# Altium schematic sheet CONN.SchDoc: CONN
size A4; DocumentNumber: 14; Revision: 1.9; SheetNumber: 14; SheetTotal: 18
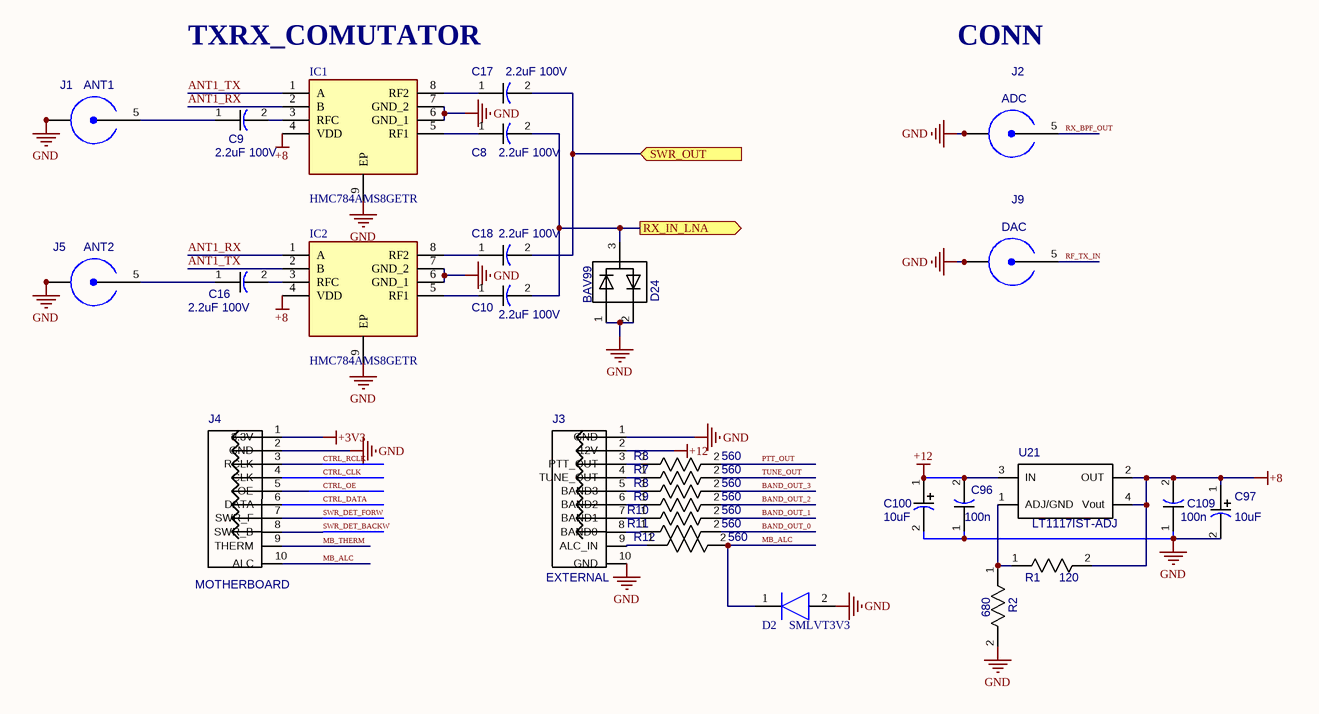
[diagram p0: CONN.SchDoc]

## Parts
C8  value 2.2uF 100V  [CAP_1206]  (hidden comment: CAP_1206)
C9  value 2.2uF 100V  [CAP_1206]  (hidden comment: CAP_1206)
C10  value 2.2uF 100V  [CAP_1206]  (hidden comment: CAP_1206)
C16  value 2.2uF 100V  [CAP_1206]  (hidden comment: CAP_1206)
C17  value 2.2uF 100V  [CAP_1206]  (hidden comment: CAP_1206)
C18  value 2.2uF 100V  [CAP_1206]  (hidden comment: CAP_1206)
C96  100n  [CAP_0805]
C97  10uF  [CAPAE_5.3x5.3h6.1]
C100  10uF  [CAPAE_5.3x5.3h6.1]
C109  100n  [CAP_0805]
D2  SMLVT3V3  [SMBJ36CATR]
D24  BAV99  [SOT23]
IC1  HMC784AMS8GETR  [SOP65P488X110-9N]
IC2  HMC784AMS8GETR  [SOP65P488X110-9N]
J1  ANT1  [31-5431]
J2  ADC  [31-5431]
J3  EXTERNAL  [90131-0126]
J4  MOTHERBOARD  [90131-0126]
J5  ANT2  [31-5431]
J9  DAC  [31-5431]
R1  value 120  [RES_0805]  (hidden comment: RES_0805)
R2  value 680  [RES_0805]  (hidden comment: RES_0805)
R3  value 560  [RES_0805]  (hidden comment: RES_0805)
R7  value 560  [RES_0805]  (hidden comment: RES_0805)
R8  value 560  [RES_0805]  (hidden comment: RES_0805)
R9  value 560  [RES_0805]  (hidden comment: RES_0805)
R10  value 560  [RES_0805]  (hidden comment: RES_0805)
R11  value 560  [RES_0805]  (hidden comment: RES_0805)
R12  value 560  [RES_0805]  (hidden comment: RES_0805)
U21  LT1117IST-ADJ  [LT1117IST-ADJ]

## Ports
RX_IN_LNA (out), SWR_OUT (in)

## Nets
+3V3: J4.1(3.3V)
+8: C97.1(PLUS) C109.2 IC1.4(VDD) IC2.4(VDD) R1.2 U21.2(OUT) U21.4(Vout)
+12: C96.2 C100.1(PLUS) J3.2(12V) U21.3(IN)
GND: C96.1 C97.2(MINUS) C100.2(MINUS) C109.1 D2.2(A) D24.1(A(D1)) D24.2(C(D2)) IC1.6(GND_1) IC1.7(GND_2) IC1.9(EP) IC2.6(GND_1) IC2.7(GND_2) IC2.9(EP) J1.1(GND) J1.2(GND) J1.3(GND) J1.4(GND) J2.1(GND) J2.2(GND) J2.3(GND) J2.4(GND) J3.1(GND) J3.10(GND) J4.2(GND) J5.1(GND) J5.2(GND) J5.3(GND) J5.4(GND) J9.1(GND) J9.2(GND) J9.3(GND) J9.4(GND) R2.2
ANT1_RX: IC1.2(B) IC2.1(A)
ANT1_TX: IC1.1(A) IC2.2(B)
BAND_OUT_0: R11.2
BAND_OUT_1: R10.2
BAND_OUT_2: R9.2
BAND_OUT_3: R8.2
CTRL_CLK: J4.4(CLK)
CTRL_DATA: J4.6(DATA)
CTRL_OE: J4.5(OE)
CTRL_RCLK: J4.3(RCLK)
MB_ALC: D2.1(K) J4.10(ALC) R12.2
MB_THERM: J4.9(THERM)
PTT_OUT: R3.2
RF_TX_IN: J9.5(CON)
RX_BPF_OUT: J2.5(CON)
RX_IN_LNA: C8.2 C10.2 D24.3(C(D1),A(D2)) ; port RX_IN_LNA
SWR_DET_BACKW: J4.8(SWR_B)
SWR_DET_FORW: J4.7(SWR_F)
SWR_OUT: C17.2 C18.2 ; port SWR_OUT
TUNE_OUT: R7.2
NetC8_1: C8.1 IC1.5(RF1)
NetC9_1: C9.1 J1.5(CON)
NetC9_2: C9.2 IC1.3(RFC)
NetC10_1: C10.1 IC2.5(RF1)
NetC16_1: C16.1 J5.5(CON)
NetC16_2: C16.2 IC2.3(RFC)
NetC17_1: C17.1 IC1.8(RF2)
NetC18_1: C18.1 IC2.8(RF2)
NetJ3_3: J3.3(PTT_OUT) R3.1
NetJ3_4: J3.4(TUNE_OUT) R7.1
NetJ3_5: J3.5(BAND3) R8.1
NetJ3_6: J3.6(BAND2) R9.1
NetJ3_7: J3.7(BAND1) R10.1
NetJ3_8: J3.8(BAND0) R11.1
NetJ3_9: J3.9(ALC_IN) R12.1
NetR1_1: R1.1 R2.1 U21.1(ADJ/GND)

## Notes on the sheet
- (near IC1) TXRX_COMUTATOR
- CONN
- Title
- Size:
- Date:
- A4
- Number:
- Time:
- Revision:
- Sheet
- of
- File:

## Library data of the parts
C96 C109 = CAP_0805: Value: 100n
C97 C100 = EEEFC_sizeB
  C100: Value: 10uF
D2 = SMLVT3V3: Diode; Manufacturer_Name: STMicroelectronics; Allied_Number: 70013736; Datasheet Link: http://www.st.com/web/en/resource/technical/document/datasheet/CD00000923.pdf; Height: 2.65mm; Manufacturer_Part_Number: SMLVT3V3; Mouser Part Number: 511-SMLVT3V3; Mouser Price/Stock: https://www.mouser.com/Search/Refine.aspx?Keyword=511-SMLVT3V3; RS Part Number: 5444821P; RS Price/Stock: http://uk.rs-online.com/web/p/products/5444821P; Allied Price/Stock: http://www.alliedelec.com/stmicroelectronics-smlvt3v3/70013736/
IC1 IC2 = HMC784AMS8GETR: Integrated Circuit; Manufacturer_Name: Analog Devices; Datasheet Link: https://componentsearchengine.com/Datasheets/1/HMC784AMS8GETR.pdf; Height: 1.1mm; Manufacturer_Part_Number: HMC784AMS8GETR; Mouser Part Number: 584-HMC784AMS8GETR; Mouser Price/Stock: https://www.mouser.co.uk/ProductDetail/Analog-Devices/HMC784AMS8GETR?qs=cslStgdnz9MA9T236Uh9mQ%3D%3D
J1 J2 J5 J9 = 31-5431
  J1: Value: ANT1
  J2: Value: ADC
  J5: Value: ANT2
  J9: Value: DAC
J3 J4 = 90131-0126: Value: *
U21 = LT1117CST-3.3
D24 = BAV99: Value: BAV99